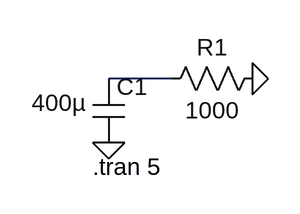
[diagram p0: schematic capacitor-discharge.asc]
capacitor-discharge.asc, the LTspice schematic file:
Version 4
SHEET 1 880 680
WIRE 192 160 128 160
FLAG 128 224 0
FLAG 272 160 0
SYMBOL cap 112 160 R0
WINDOW 3 -61 24 Left 2
SYMATTR Value 400µ
SYMATTR InstName C1
SYMATTR SpiceLine2 IC=550
SYMBOL res 288 144 R90
WINDOW 0 0 56 VBottom 2
WINDOW 3 32 56 VTop 2
SYMATTR InstName R1
SYMATTR Value 1000
TEXT 112 248 Left 2 !.tran 5

The netlist it stands for:
* capacitor-discharge.asc
C1 N001 0 400µ IC=550
R1 0 N001 1000
.tran 5
.backanno
.end